# Altium project 20W_MultiOutput_FlybackCvt.PrjPcb
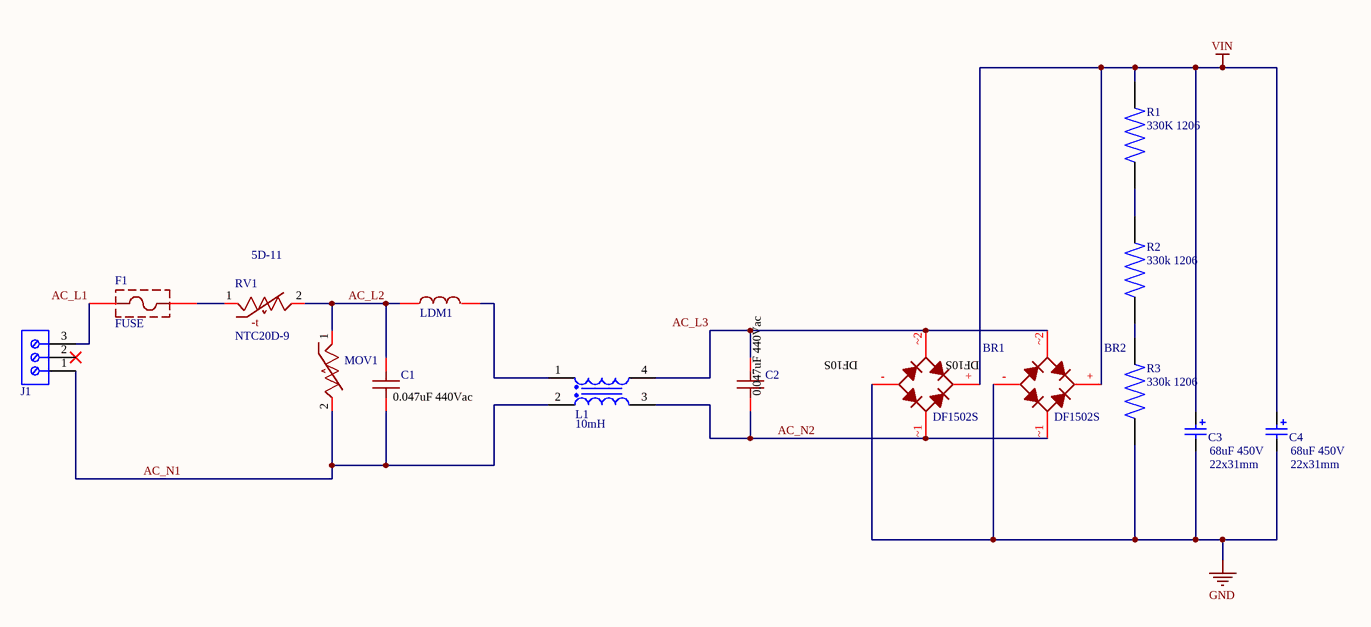
[diagram p0: EMI_Filter.SchDoc]
3 sheets, 103 parts. Net scope: global (net labels, ports and power ports of the same name join across sheets).
Board files: PCB.PcbDoc, PCB2.PcbDoc, PCB1.PcbDoc
Sheets:
  EMI_Filter.SchDoc
  Controller.SchDoc
  Transformer.SchDoc

## Sheet EMI_Filter.SchDoc: EMI Filter
size A3; SheetNumber: 1; SheetTotal: 3

### Parts
BR1  DBLS208GH  [DB SMD]  (value not drawn)
BR2  DBLS208GH  [DB SMD]  (value not drawn)
C1  Parameter 1: 0.047uF 440Vac  [R474I2470CKA2M]  (hidden comment: R474I2470CKA2M)
C2  Parameter 1: 0.047uF 440Vac  [R474I2470CKA2M]  (hidden comment: R474I2470CKA2M)
C3  82uF  [WCAP-AI3H_D22H30]  (value not drawn)
C4  82uF  [WCAP-AI3H_D22H30]  (value not drawn)
F1  FUSE  [FUSE]
J1  16A, 300V  [691213710003]  (value not drawn)
L1  10mH  [WE-FC_ET20H]
LDM1  SN5-300  [SN5300]  (value not drawn)
MOV1  MOV-14D751K  [B72214S2271K101]  (value not drawn)
R1  330K 1206  [RESC3116X65N]
R2  330k 1206  [RESC3116X65N]
R3  330k 1206  [RESC3116X65N]
RV1  NTC20D-9  [NTC20D9]

### Nets
GND: BR1.- BR2.- C3.2(N) C4.2(N) R3.1
VIN: BR1.+ BR2.+ C3.1(P) C4.1(P) R1.2
AC_L1: F1.1 J1.3
AC_L2: C1.1 LDM1.1 MOV1.1 RV1.2
AC_L3: BR1.~2 BR2.~2 C2.1 L1.4
AC_N1: C1.2 J1.1 L1.2 MOV1.2
AC_N2: BR1.~1 BR2.~1 C2.2 L1.3
NetF1_2: F1.2 RV1.1
NetL1_1: L1.1 LDM1.2
NetR1_1: R1.1 R2.2
NetR2_1: R2.1 R3.2

Not connected (* = marked no-connect by the designer): J1 2*

### Notes on the sheet
- (near RV1) 5D-11
- (near BR1) DF1502S
- (near BR2) DF1502S
- 68uF 450V
- 22x31mm
- (near C4) 68uF 450V
- (near C4) 22x31mm
- Project:
- XEVTECH COMPANY LIMITED
- Address: C17, Khu Barya City
- Drawn by:
- Size:
- A3
- Sheet
- of
- Date:
- TP Bà Rịa, Tỉnh Bà Rịa Vũng Tàu
- Email: admin@xevtech.vn
- Phone: 090 172 8898
- (in symbol BRIDGE RECT 1.2KV 2A) DF10S
- (in symbol NTC20D-9) -t

### Library data of the parts
BR1 BR2 = BRIDGE RECT 1.2KV 2A: Bridge Rectifier Single Phase Standard 1.2 kV Surface Mount DBLS; Manufacturer: FairchildSemiconductor; Peak Average Forward Current: 1.5@Ta=40CA; Peak Reverse Repetitive Voltage: 1000V; Peak Reverse Current: 5uA; Peak Forward Voltage: 1.1@1AV; Supplier 1: Digikey; Supplier Part Number 1: 1801-DBLS158GCT-ND; Datasheet Version: Rev. 1.5, 05/2015; Package: 4SDIPSMD; Operating Temperature: -55to150°C; Configuration: Single; Package Reference: SDIP 4L; Datasheet URL: http://www.farnell.com/datasheets/1941063.pdf; Packaging: Tape&Reel; Manufacturer URL: https://www.fairchildsemi.com/; Bridge Type: SinglePhase; Mounting Technology: SurfaceMount; Category: BridgeRectifier; Package Description: 4-Pin Surface Mount Device, Body 8.28 x 6.35 mm, Pitch 5.1 mm; Mounting: SurfaceMount
C1 C2 = R474I2470CKA2M: 0.047 µF Film Capacitor 440V 1000V (1kV) Polypropylene (PP), Metallized Radial; Manufacturer 1: KEMET; Description 1: Cap Film 0.047UF 20% 1KVDC Rad; Category 1: Film Capacitors; Capacitance: 47nF; Tolerance: 20%; Ratings: AEC-Q200,X1; Supplier 1: Digikey; Supplier Part Number 1: 399-17231-1-ND; Manufacturer Part Number 1: R474I2470CKA2M; RoHS 1: Yes; Stock 1: 4929; Pricing 1: 1=0,69, 10=0,482, 50=0,4056, 100=0,3302, 500=0,27518 (USD); ComponentLink1URL: https://datasheet.ciiva.com/46436/1848873-46436253.pdf?src-supplier=Element14; ComponentLink1Description: https://datasheet.ciiva.com/46436/1848873-46436253.pdf?src-supplier=Element14; Mount: Through Hole; Case/Package: Radial; Dielectric Material: PP; Min Operating Temperature: -40°C; Max Operating Temperature: 110°C; Series: R47; Packaging: Cut Tape; Voltage Rating (AC): 440V; Voltage Rating (DC): 1kV; Termination: PC Pins; RoHS Compliant: Yes
C3 C4 = 861141483002: WCAP-AI3H Aluminum Electrolytic Capacitor, Snap-In, D22xH30mm, 82uF, 450V; Manufacturer: Wurth Elektronik; Capacitance Tolerance: +/-20%; Dissipation Factor: 20%; Endurance: 3000h; Leakage Current: 576.28uA; Ripple Current: 640mA; Technical Reference: ANJN300820M450DSIC3C000; ComponentLink1Description: Manufacturer Link; ComponentLink1URL: https://www.we-online.com/redexpert/article/861141483002?ad; ComponentLink2Description: Datasheet; ComponentLink2URL: https://www.we-online.com/redexpert/spec/861141483002?ad; Category: Aluminum Electrolytic Capacitors; Match Code: WCAP-AI3H; Manufacturer Part Number: 861141483002; Mount: Through Hole; Operating Temperature Max: 105°C; Operating Temperature Min: -25°C; Packaging: Tray; Height: 30mm; Diameter: 22mm; Capacitance: 82uF; Rated Voltage (DC): 450V
F1 = FUSE: 2 A 250 V AC 125 V DC Fuse Board Mount (Cartridge Style); Manufacturer: Littelfuse; Manufacturer Part Number: 0505025.MXP; RoHS: Yes; Category: Fuses; Stock 1: 3122; Pricing 1: 1=5.43, 5=5.244, 10=5.057, 50=3.9336, 100=3.278, 250=3.18436, 500=2.71606, 1000=2.57558 (USD); ComponentLink1URL: https://datasheet.ciiva.com/26890/getdatasheetpartid-706019-26890404.pdf?src-supplier=Verical; ComponentLink1Description: https://datasheet.ciiva.com/26890/getdatasheetpartid-706019-26890404.pdf?src-supplier=Verical; ComponentLink2URL: https://datasheet.ciiva.com/29618/littelfuse-fuse-505-datasheet-pdf-29618152.pdf?src-supplier=Digi-Key; ComponentLink2Description: https://datasheet.ciiva.com/29618/littelfuse-fuse-505-datasheet-pdf-29618152.pdf?src-supplier=Digi-Key; ComponentLink3URL: https://datasheet.ciiva.com/300/littelfuse-fuse-505-300507.pdf?src-supplier=Digi-Key; ComponentLink3Description: https://datasheet.ciiva.com/300/littelfuse-fuse-505-300507.pdf?src-supplier=Digi-Key; ComponentLink4URL: https://datasheet.ciiva.com/7314/697468-7314411.pdf?src-supplier=Newark; ComponentLink4Description: https://datasheet.ciiva.com/7314/697468-7314411.pdf?src-supplier=Newark
J1 = 691213710003: WR-TBL Series 213 Horizontal Entry Modular, THT, pitch 5mm, 3p; Manufacturer: Wurth Elektronik; Modularity: Yes; Rated Current: 10A; ComponentLink1Description: Datasheet Link; ComponentLink1URL: https://www.we-online.com/redexpert/spec/691213710003?ad; ComponentLink2Description: Supplier 1 URL; ComponentLink2URL: N/A; Manufacturer Part Number: 691213710003; Category: Terminal Blocks; Match Code: WR-TBL; Mount: Through Hole; Operating Temperature Max: 105°C; Operating Temperature Min: -40°C; Packaging: Box; Application: Rising Cage Clamp; Number of Pins: 3; Number of Rows: 1; Orientation: Horizontal; Pitch: 5mm; Working Voltage: 300V; ComponentLink3Description: Supplier 2 URL; ComponentLink3URL: N/A; ComponentLink4Description: Supplier 3 URL; ComponentLink4URL: https://www.thegioiic.com/kf128-3-v-domino-3-chan-thang-5mm-300v-10a-han-pcb-loai-tot; Supplier 1 Name: Mouser; Supplier 1 SN: N/A; Supplier 1 URL: N/A; Supplier 2 Name: Digi-Key; Supplier 2 SN: N/A; Supplier 2 URL: N/A; Supplier 3 Name: thegioiic; Supplier 3 SN: N/A; Supplier 3 URL: https://www.thegioiic.com/kf128-3-v-domino-3-chan-thang-5mm-300v-10a-han-pcb-loai-tot; Value: 16A, 300V
L1 = 7448640399: WE-FC THT Common Mode Power Line Choke, ET20H, 5.9mH, 1.15A, 0.28Ω; Manufacturer: Wurth Elektronik; Insulation Test Voltage (AC): 2000V; Material: MnZn; Rated Voltage (AC): 250V; ComponentLink1Description: Website Link; ComponentLink1URL: https://www.we-online.com/redexpert/article/7448640399?ad; ComponentLink2Description: Datasheet Link; ComponentLink2URL: https://www.we-online.com/redexpert/spec/7448640399?ad; Manufacturer Part Number: 7448640399; Category: Common Mode Chokes; Match Code: WE-FC; Mount: Through Hole; Operating Temperature Max: 125°C; Operating Temperature Min: -40°C; Packaging: Tray; Case/Size Code: ET20H; Length: 21.3mm; Width: 21.3mm; Height: 17.8mm; DC Resistance: 0.28Ω; Inductance: 5.9mH; Rated Current: 1.15A
LDM1 = SN5-300: Filters 25uH 2A DCR=42mOhms; ComponentLink1URL: https://www.allegromicro.com/~/media/Files/Datasheets/ACS72981-Datasheet.ashx?src-supplier=Digi-Key; ComponentLink1Description: https://www.allegromicro.com/~/media/Files/Datasheets/ACS72981-Datasheet.ashx?src-supplier=Digi-Key; Supplier 1: Digikey; Supplier Part Number 1: 399-20548-ND
MOV1 = MOV-14D751K: 750 V 4.5 kA Varistor 1 Circuit Through Hole Disc 14mm; Manufacturer 1: Bourns; Description 1: Var MOV 460VAC/615VDC 4500A 750V Radial Bulk; Category 1: Varistors; Capacitance: 270pF; Voltage Rating (DC): 750V; Max Surge Current: 4.5kA; Current Rating: 50A; Tolerance: 10%; Max Voltage Rating (AC): 460V; Max Voltage Rating (DC): 615V; Clamping Voltage: 1.24kV; Number of Circuits: 1; Energy: 143J; Min Varistor Voltage: 675V; Max Varistor Voltage: 825V; Supplier 1: Digikey; Manufacturer Part Number 1: MOV-14D751K; RoHS 1: Yes; Stock 1: 4415; Pricing 1: 1=0,53, 10=0,458, 400=0,31723, 1200=0,20742, 5200=0,17691, 10000=0,16471 (USD); ComponentLink1URL: https://media.digikey.com/pdf/Data%20Sheets/Bourns%20PDFs/GMOV_Series_DS.pdf?src-supplier=Digi-Key; ComponentLink1Description: https://media.digikey.com/pdf/Data%20Sheets/Bourns%20PDFs/GMOV_Series_DS.pdf?src-supplier=Digi-Key; Supplier Part Number 1: 118-MOV-14D751K-ND; Mount: Radial,Through Hole; Case/Package: Radial; Weight: 0.105822oz; Min Operating Temperature: -40°C; Max Operating Temperature: 85°C; Packaging: Bulk; Package Quantity: 500; Clamping Current: 50A; Varistor Voltage: 750V; Series: -; Diameter: 14mm; Lead Pitch: 7.5mm; Radiation Hardening: No; RoHS Compliant: Yes; ComponentLink2URL: https://datasheet.ciiva.com/3026/mov14d-3026373.pdf?src-supplier=Avnet; ComponentLink2Description: https://datasheet.ciiva.com/3026/mov14d-3026373.pdf?src-supplier=Avnet; ComponentLink3URL: https://datasheet.ciiva.com/369/mov14d-369435.pdf?src-supplier=Digikey; ComponentLink3Description: https://datasheet.ciiva.com/369/mov14d-369435.pdf?src-supplier=Digikey
R1-R3 = RC1206JR-0713RL: 13 Ohms Â±5% 0.25W, 1/4W Chip Resistor 1206 (3216 Metric) Moisture Resistant Thick Film; MF: Yageo; Check_prices: https://www.snapeda.com/parts/RC1206JR-0713RL/Yageo/view-part/?ref=eda; Value: *; Availability: In Stock; MP: RC1206JR-0713RL; Price: None; Package: 3116 Yageo; SnapEDA_Link: https://www.snapeda.com/parts/RC1206JR-0713RL/Yageo/view-part/?ref=snap; Purchase-URL: https://pricing.snapeda.com/search/part/RC1206JR-0713RL/?ref=eda
RV1 = NTC20D-9: NTC Thermistor 20Ohms DIP 1A 25DegC  20R 9MM; MP: B72214S2271K101; MF: EPCOS; Digi-Key_Part_Number: 495-1441-ND; Check_prices: https://www.snapeda.com/parts/B72214S2271K101/EPCOS/view-part/?ref=eda; Package: None; Value: *; SnapEDA_Link: https://www.snapeda.com/parts/B72214S2271K101/EPCOS/view-part/?ref=snap; Purchase-URL: https://pricing.snapeda.com/search/part/B72214S2271K101/?ref=eda

## Sheet Controller.SchDoc: Controller
size A3; SheetNumber: 2; SheetTotal: 3
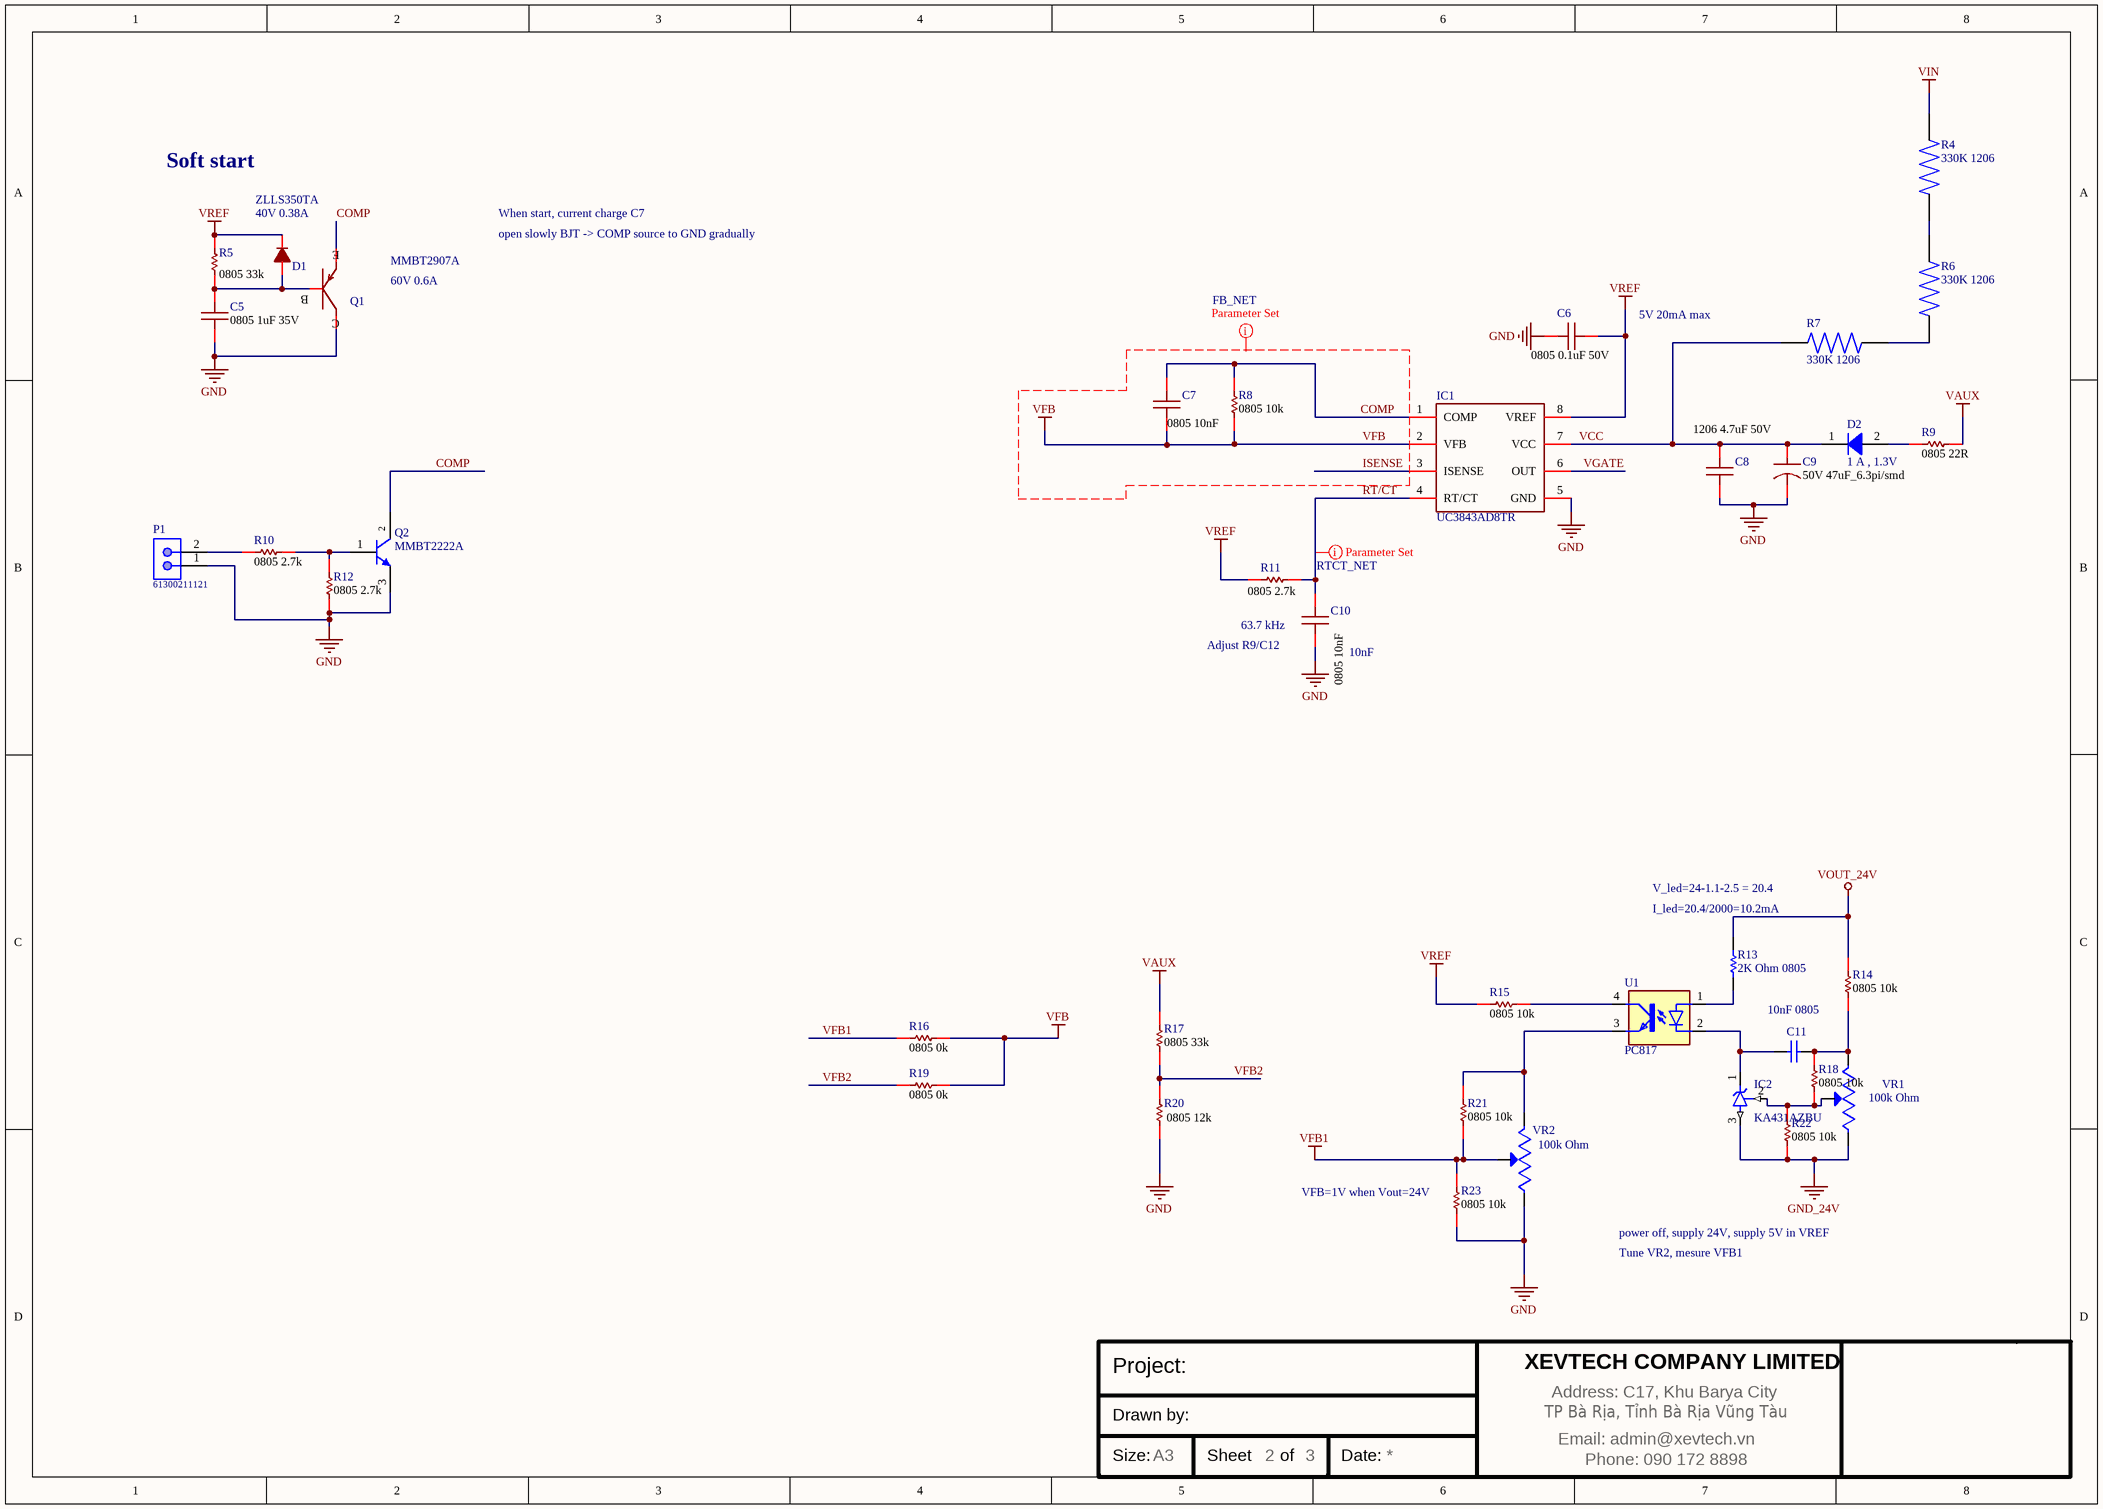
[diagram p1: Controller.SchDoc]

### Parts
C5  value 0805 1uF 35V  [CAP 0805]  (hidden comment: GRM219R7YA105KA12D)
C6  value 0805 0.1uF 50V  [CAP 0805]  (hidden comment: CL21B104KBCNNNC)
C7  value 0805 10nF  [CAP 0805]  (hidden comment: GRM2195C1H103JA01D)
C8  value 1206 4.7uF 50V  [Cap 1206]  (hidden comment: C3216X7R1H475M160AC)
C9  value 50V 47uF_6.3pi/smd  [C-50-47uf_alu]  (hidden comment: EEE-FK1H470XL)
C10  value 0805 10nF  [CAP 0805]  (hidden comment: GCM216R71H102KA37D)
C11  10nF 0805  [CAP_0805]
D1  PMEG3010EB,115  [SOD 523]  (value not drawn)
D2  1 A , 1.3V  [SMA (DO-214AC)]
IC1  UC3843AD8TR  [UC3843_SOIC8]
IC2  KA431AZBU  [SOT23-3]
P1  61300211121  [61300211121]
Q1  MMBT2907A  [SOT 23 3]
Q2  MMBT2222A  [MMBT-SOT23]
R4  330K 1206  [RESC3116X65N]
R5  value 0805 33k  [RES 0805]  (hidden comment: RC0805FR-0733KL)
R6  330K 1206  [RESC3116X65N]
R7  330K 1206  [RESC3116X65N]
R8  value 0805 10k  [RES 0805]  (hidden comment: RC0805FR-1310KL)
R9  value 0805 22R  [RES 0805]  (hidden comment: RC0805FR-0722RP)
R10  value 0805 2.7k  [Res 0805]  (hidden comment: RC0805FR-1312KL)
R11  value 0805 2.7k  [Res 0805]  (hidden comment: RC0805FR-1312KL)
R12  value 0805 2.7k  [Res 0805]  (hidden comment: RC0805FR-1312KL)
R13  2K Ohm 0805  [RESISTOR_0805]
R14  value 0805 10k  [Res 0805]  (hidden comment: RK73B2ATTD104J)
R15  value 0805 10k  [Res 0805]  (hidden comment: RK73B2ATTD104J)
R16  value 0805 0k  [RES 0805]  (hidden comment: RC0805FR-1310KL)
R17  value 0805 33k  [RES 0805]  (hidden comment: RC0805FR-1310KL)
R18  value 0805 10k  [Res 0805]  (hidden comment: RK73B2ATTD104J)
R19  value 0805 0k  [RES 0805]  (hidden comment: RC0805FR-1310KL)
R20  value 0805 12k  [RES 0805]  (hidden comment: RC0805FR-1310KL)
R21  value 0805 10k  [Res 0805]  (hidden comment: RK73B2ATTD104J)
R22  value 0805 10k  [Res 0805]  (hidden comment: RK73B2ATTD104J)
R23  value 0805 10k  [Res 0805]  (hidden comment: RK73B2ATTD104J)
U1  PC817  [PC817]
VR1  3296W-1-250  [TRIM_3296W-1-250]  (value not drawn)
VR2  3296W-1-250  [TRIM_3296W-1-250]  (value not drawn)

### Nets
GND: C5.2 C6.1 C8.2 C9.2 C10.2 IC1.5(GND) P1.1 Q1.C Q2.3(E) R12.2 R20.1 R23.2 VR2.1(CCW)
GND_24V: IC2.3(A) R22.2 VR1.1(CCW)
VAUX: R9.1 R17.2
VFB: C7.2 IC1.2(VFB) R8.1 R16.1 R19.1
VFB1: R16.2 R21.2 R23.1 VR2.2(WIPER)
VIN: R4.2
VOUT_24V: R13.2 R14.2
VREF: C6.2 D1.K IC1.8(VREF) R5.1 R11.2 R15.2
COMP: C7.1 IC1.1(COMP) Q1.E Q2.2(C) R8.2
ISENSE: IC1.3(ISENSE)
RT/CT: C10.1 IC1.4(RT/CT) R11.1
VCC: C8.1 C9.1 D2.1(K) IC1.7(VCC) R7.2
VFB2: R17.1 R19.2 R20.2
VGATE: IC1.6(OUT)
NetC5_1: C5.1 D1.A Q1.B R5.2
NetC11_1: C11.1 R14.1 R18.1 VR1.3(CW)
NetC11_2: C11.2 IC2.1(C) U1.2(C)
NetD2_2: D2.2(A) R9.2
NetIC2_2: IC2.2(REF) R18.2 R22.1 VR1.2(WIPER)
NetP1_2: P1.2 R10.1
NetQ2_1: Q2.1(B) R10.2 R12.1
NetR4_1: R4.1 R6.2
NetR6_1: R6.1 R7.1
NetR13_1: R13.1 U1.1(A)
NetR15_1: R15.1 U1.4(COL)
NetR21_1: R21.1 U1.3(EMIT) VR2.3(CW)

### Layout directives
net class FB_NET: COMP, ISENSE, VFB
net class RTCT_NET: RT/CT

### Notes on the sheet
- Soft start
- ZLLS350TA
- 40V 0.38A
- When start, current charge C7
- open slowly BJT -> COMP source to GND gradually
- 60V 0.6A
- 5V 20mA max
- (near C10) Adjust R9/C12
- 63.7 kHz
- (near C10) 10nF
- V_led=24-1.1-2.5 = 20.4
- (near R13) I_led=20.4/2000=10.2mA
- (near VR1) 100k Ohm
- (near VR2) 100k Ohm
- (near R23) VFB=1V when Vout=24V
- power off, supply 24V, supply 5V in VREF
- Tune VR2, mesure VFB1
- Project:
- XEVTECH COMPANY LIMITED
- Address: C17, Khu Barya City
- Drawn by:
- Size:
- A3
- Sheet
- of
- Date:
- TP Bà Rịa, Tỉnh Bà Rịa Vũng Tàu
- Email: admin@xevtech.vn
- Phone: 090 172 8898

### Library data of the parts
C5 = Cap 0805 1uF: 1 µF ±10% 35V Ceramic Capacitor X7R 0805 (2012 Metric); Supplier 1: Digi-Key; Supplier Part Number 1: 490-10494-1-ND
C6 = Cap 0805 0.1uF: 0.1 µF ±10% 50V Ceramic Capacitor X7R 0805 (2012 Metric); Manufacturer 1: Samsung; Description 1: Multilayer Ceramic Capacitor, 0.1 uF, 50 V, ± 10%, X7R, 0805 [2012 Metric]; Category 1: Ceramic Capacitors; Supplier 1: Digi-Key; Supplier Part Number 1: 1276-1003-1-ND; Manufacturer Part Number 1: CL21B104KBCNNNC; RoHS 1: Yes; Stock 1: 559254; Pricing 1: 1=0,1, 10=0,044, 50=0,024, 100=0,0196, 500=0,01404, 1000=0,01103 (USD); ComponentLink1URL: https://datasheet.ciiva.com/25710/cl21b104kbcnnnc-25710182.pdf?src-supplier=Digi-Key; ComponentLink1Description: https://datasheet.ciiva.com/25710/cl21b104kbcnnnc-25710182.pdf?src-supplier=Digi-Key; ComponentLink2URL: https://datasheet.ciiva.com/29199/454152-da-01-en-vs-kondensator-0805-29199814.pdf?src-supplier=Conrad; ComponentLink2Description: https://datasheet.ciiva.com/29199/454152-da-01-en-vs-kondensator-0805-29199814.pdf?src-supplier=Conrad
C7 = Cap 0805 10nF: 10000 pF ±5% 50V Ceramic Capacitor C0G, NP0 0805 (2012 Metric); Manufacturer 1: Murata; Manufacturer Part Number 1: GRM21BR61H106KE43L; Description 1: Capacitor Ceramic Multilayer; Category 1: Ceramic Capacitors; Supplier 1: Digikey; Supplier Part Number 1: 490-1642-1-ND; RoHS 1: Yes; Stock 1: 19692; Pricing 1: 1=0,3, 10=0,209, 50=0,139, 100=0,1182, 500=0,08342, 1000=0,073 (USD); ComponentLink1URL: https://datasheet.octopart.com/GRM21BR61H106KE43L-Murata-datasheet-155345082.pdf?src-supplier=Element14; ComponentLink1Description: https://datasheet.octopart.com/GRM21BR61H106KE43L-Murata-datasheet-155345082.pdf?src-supplier=Element14; ComponentLink2URL: https://search.murata.co.jp/Ceramy/image/img/A01X/G101/ENG/GRM21BR61H106KE43-01A.pdf?src-supplier=Digi-Key; ComponentLink2Description: https://search.murata.co.jp/Ceramy/image/img/A01X/G101/ENG/GRM21BR61H106KE43-01A.pdf?src-supplier=Digi-Key; ComponentLink3URL: https://datasheet.octopart.com/GRM21BR61H106KE43L-Murata-datasheet-165579666.pdf?src-supplier=TME; ComponentLink3Description: https://datasheet.octopart.com/GRM21BR61H106KE43L-Murata-datasheet-165579666.pdf?src-supplier=TME
C8 = Cap 1206 4.7uF: 4.7 µF ±20% 50V Ceramic Capacitor X7R 1206 (3216 Metric); Manufacturer 1: TDK; Manufacturer Part Number 1: CGA5L1X7R1V106M160AC; Description 1: Cap Ceramic 10uF 35V X7R 20% SMD 1206 125°C Blister Plastic T/R; Category 1: Ceramic Capacitors; Capacitance: 10uF; Voltage Rating: 35V; RoHS 1: Yes; Stock 1: 4126; Pricing 1: 1=0,72, 10=0,53, 50=0,4242, 100=0,3636, 500=0,28784, 1000=0,2424 (USD); Mount: Surface Mount; Case/Package: 1206; Case Code (Imperial): 1206; Case Code (Metric): 3216; Weight: 0.000571oz; Min Operating Temperature: -55°C; Max Operating Temperature: 125°C; Packaging: Tape and Reel; Tolerance: 20%; Dielectric: X7R; Termination: SMD/SMT; Voltage Rating (DC): 35V; Package Quantity: 2000; Series: CGA; Length: 0.126inch; Width: 1.6mm; Height: 1.6mm; Thickness: 0.071inch; Ratings: AEC-Q200; RoHS Compliant: Yes; ComponentLink1URL: https://product.tdk.com/info/en/catalog/datasheets/mlcc_automotive_general_en.pdf?src-supplier=Digi-Key; ComponentLink1Description: https://product.tdk.com/info/en/catalog/datasheets/mlcc_automotive_general_en.pdf?src-supplier=Digi-Key; ComponentLink2URL: http://product.tdk.com/capacitor/mlcc/detailed_information.php?lang=en&ref=jp&part_no=CGA5L1X7R1V106M160AC&src-supplier=Mouser; ComponentLink2Description: http://product.tdk.com/capacitor/mlcc/detailed_information.php?lang=en&ref=jp&part_no=CGA5L1X7R1V106M160AC&src-supplier=Mouser; ComponentLink3URL: http://product.tdk.com/capacitor/mlcc/class/print_detail_pdf.php?lang=en&part_no=CGA5L1X7R1V106M160AC&src-supplier=Avnet; ComponentLink3Description: http://product.tdk.com/capacitor/mlcc/class/print_detail_pdf.php?lang=en&part_no=CGA5L1X7R1V106M160AC&src-supplier=Avnet; ComponentLink4URL: https://product.tdk.com/info/en/catalog/spec/mlccspec_automotive_general_midvoltage_en.pdf?src-supplier=Digi-Key; ComponentLink4Description: https://product.tdk.com/info/en/catalog/spec/mlccspec_automotive_general_midvoltage_en.pdf?src-supplier=Digi-Key; Supplier 1: Digikey; Supplier Part Number 1: 445-8033-1-ND
C9 = Capacitor-50V 47u_6.3pi: CAP ALUM 47UF 20% 50V SMD; Manufacturer: Panasonic; Supplier Part Number: 10-EEE-FK1H470XLCTND; Package/Case: 6.3mm (dia); Supplier 1: Digi-Key; Supplier Part Number 1: 10-EEE-FK1H470XLCT-ND
C10 = Cap 0805 1nF: 1000 pF 50 VDC 10% 0805 X7R; Manufacturer 1: Murata; Manufacturer Part Number 1: GRM21BR61H106KE43L; Description 1: Capacitor Ceramic Multilayer; Category 1: Ceramic Capacitors; Supplier 1: Digikey; Supplier Part Number 1: 490-6057-1-ND; RoHS 1: Yes; Stock 1: 19692; Pricing 1: 1=0,3, 10=0,209, 50=0,139, 100=0,1182, 500=0,08342, 1000=0,073 (USD); ComponentLink1URL: https://datasheet.octopart.com/GRM21BR61H106KE43L-Murata-datasheet-155345082.pdf?src-supplier=Element14; ComponentLink1Description: https://datasheet.octopart.com/GRM21BR61H106KE43L-Murata-datasheet-155345082.pdf?src-supplier=Element14; ComponentLink2URL: https://search.murata.co.jp/Ceramy/image/img/A01X/G101/ENG/GRM21BR61H106KE43-01A.pdf?src-supplier=Digi-Key; ComponentLink2Description: https://search.murata.co.jp/Ceramy/image/img/A01X/G101/ENG/GRM21BR61H106KE43-01A.pdf?src-supplier=Digi-Key; ComponentLink3URL: https://datasheet.octopart.com/GRM21BR61H106KE43L-Murata-datasheet-165579666.pdf?src-supplier=TME; ComponentLink3Description: https://datasheet.octopart.com/GRM21BR61H106KE43L-Murata-datasheet-165579666.pdf?src-supplier=TME
C11 = 0108058281050: CAP, size 0805, 8.2 uF, 50 VDC; Manufacture Name: TDK; Manufacture SN: CGA4C2C0G1H822J060AA; Capacitance: 8.2 uF; Tolerance: +/-5%; Voltage Rating DC: 50 VDC; ComponentLink2Description: Datasheet; ComponentLink2URL: https://product.tdk.com/system/files/dam/doc/product/capacitor/ceramic/mlcc/catalog/mlcc_automotive_general_en.pdf?ref_disty=mouser; Operating Temperature: -55 to +125degC; Packaging: Tape and Reel; Mounting Technology: SMT; Size: 0805; Supplier 1 Name: Mouser; Supplier 1 SN: 810-CGA4C2C0G1H822J; Supplier 1 URL: https://www.mouser.vn/ProductDetail/TDK/CGA4C2C0G1H822J060AA?qs=FxQuwy19cyAK0jQ6P5l0pQ%3D%3D&utm_source=mouser-refine-download&utm_medium=file&utm_campaign=CGA4C2C0G1H822J060AA&utm_content=TDK; Supplier 2 Name: Digi-Key; Supplier 2 SN: 445-6946-2-ND; Supplier 2 URL: https://www.digikey.com/en/products/detail/tdk-corporation/cga4c2c0g1h822j060aa/2672839; Supplier 3 Name: thegioiic; Supplier 3 SN: OEM; Supplier 3 URL: N/A; Value: 8.2 uF, 50 VDC
D1 = Diode 30V 1A: Diode 30 V 1A Surface Mount SOD-523; Manufacturer 1: Nexperia; Description 1: Rectifier Diode, Schottky, 1 Phase, 1 Element, 1A, Silicon; Category 1: Rectifier Diodes; Max Reverse Leakage Current: 500uA; Max Surge Current: 3A; Max Repetitive Reverse Voltage (Vrrm): 30V; Peak Non-Repetitive Surge Current: 5A; Element Configuration: 5460ElementConfiguration; Forward Voltage: 680mV; Supplier 1: Digikey; Supplier Part Number 1: 1727-5834-1-ND; ComponentLink1URL: https://datasheet.octopart.com/BZX585-C9V1%2C135-Nexperia-datasheet-81456219.pdf?src-supplier=Future+Electronics; ComponentLink1Description: https://datasheet.octopart.com/BZX585-C9V1%2C135-Nexperia-datasheet-81456219.pdf?src-supplier=Future+Electronics; Manufacturer Part Number 1: PMEG3010EB,115; RoHS 1: Yes; Stock 1: 7761; Pricing 1: 1=0,46, 10=0,326, 100=0,1644, 500=0,14572, 1000=0,11341, 3000=0,1015, 6000=0,09923, 9000=0,08789, 30000=0,08676, 75000=0,07371 (USD); Mount: 8Mount; Number of Pins: 2NUMBER; Min Operating Temperature: -65°C; Max Operating Temperature: 150°C; Forward Current: 1A; Max Reverse Voltage (DC): 30V; Max Reverse Current: 500uA; Average Rectified Current: 1A; Max Forward Surge Current (Ifsm): 5A; Radiation Hardening: 5898YesNo; RoHS Compliant: Yes; Lead Free: 5697LeadFree; Reach SVHC Compliant: 4186SVHC; ComponentLink2URL: https://assets.nexperia.com/documents/packing/SOD523_115.pdf?src-supplier=Digikey; ComponentLink2Description: https://assets.nexperia.com/documents/packing/SOD523_115.pdf?src-supplier=Digikey; ComponentLink3URL: https://datasheet.octopart.com/PMEG3010EB%2C115-Nexperia-datasheet-12552804.pdf?src-supplier=Farnell; ComponentLink3Description: https://datasheet.octopart.com/PMEG3010EB%2C115-Nexperia-datasheet-12552804.pdf?src-supplier=Farnell
D2 = RS1M: Rectifiers 1000V 1a Fast Rect SMa; Manufacturer: onsemi; Max Surge Current: 30 A; Peak Reverse Voltage: 1 kV; Power Dissipation: 1.19 W; Recovery Time: 500 ns; Reverse Current: 5 uA; Type: Rectifiers; Supplier 1 URL: https://www.mouser.vn/ProductDetail/onsemi-Fairchild/RS1M?qs=e%2FRqmsgwm9icSRWI%2F467wA%3D%3D; Supplier 2 URL: https://www.digikey.com/en/products/detail/onsemi/rs1m/1048919; Supplier 3 URL: https://www.thegioiic.com/fr107-rs1m-sma-diode-chinh-luu-1a-1kv; Value: 1 A , 1.3V; Forward Current: 1 A; Forward Voltage: 1.3 V; Maximum Diode Capacitance: N/A; Manufacturer Part Number: RS1M; Supplier 1: Mouser; Supplier 1 Part Number: 512-RS1M; Supplier 2: Digi-Key; Supplier 2 Part Number: RS1MFSTR-ND; Supplier 3: thegioiic; Supplier 3 Part Number: FR107 RS1M; Mount: SMD/SMT; Operating Temperature Max: + 85 C; Operating Temperature Min: - 40 C; Package / Case: DO-214AC; ComponentLink1Description: Datasheet; ComponentLink1URL: https://www.mouser.vn/datasheet/2/308/1/RS1M_D-2320127.pdf; Packaging: Tape and Reel; LCSC Part #: N/A
IC1 = UC3843AD8TR: UC3843 Switching IC 8.4V 500kHz; Supplier 1: Digikey; Supplier Part Number 1: 296-27152-1-ND
P1 = 61300211121: WR-PHD Pin Header, THT, pitch 2.54mm, Single Row, Vertical, 2p; Manufacturer: Wurth Elektronik; Pin Number: 2; Rated Current: 3A; Working Voltage: 250VAC; Withstanding Voltage: 500VAC; Contact Resistance: 20mOhm; Supply Name 1: Mouser; ComponentLink1Description: Manufacturer; ComponentLink1URL: http://www.we-online.de; ComponentLink2Description: Datasheet; ComponentLink2URL: https://www.we-online.com/catalog/datasheet/61300211121.pdf; Manufacturer Part Number: 61300211121; Published Date: May 2020; Pitch: 2.54mm; Operating Temperature: -40 to +105degC; Mounting Technology: THT; Packaging: Bag; Gender: Pin Header; Row Number: Single; Orientation: Vertical; ComponentLink3Description: Global Supply; ComponentLink3URL: https://www.mouser.vn/ProductDetail/Wurth-Elektronik/61300211121?qs=t4813l51qx%252B1A5GYDQxPlw%3D%3D; Supplier 1 Name: Mouser; Supplier 1 SN: 710-61300211121; Supplier 1 URL: https://www.mouser.vn/ProductDetail/Wurth-Elektronik/61300211121?qs=t4813l51qx%252B1A5GYDQxPlw%3D%3D; Supplier 2 Name: Digi-Key; Supplier 2 SN: N/A; Supplier 2 URL: N/A; Supplier 3 Name: thegioiic; Supplier 3 SN: N/A; Supplier 3 URL: N/A
Q1 = BJT PNP 40V: Trans GP BJT PNP 40V 0.2A 300mW Automotive 3-Pin SOT-23 T/R; Manufacturer 1: ON Semiconductor; Manufacturer Part Number 1: SMMBT3906LT1G; Category 1: BJTs; Supplier 1: Digikey; Supplier Part Number 1: SMMBT3906LT1GOSCT-ND; RoHS 1: Yes; Description 1: Trans GP BJT PNP 40V 0.2A 300mW Automotive 3-Pin SOT-23 T/R; Stock 1: 92580; Pricing 1: 1=0,17, 10=0,124, 100=0,0667, 500=0,05236, 1000=0,03636, 3000=0,03012, 6000=0,02848, 9000=0,02424, 30000=0,02242, 75000=0,01939, 150000=0,01612 (USD); Lead Free: 5697LeadFree; ComponentLink1URL: https://datasheet.ciiva.com/980/mmbt3906lt1-d-980808.pdf?src-supplier=Digikey; ComponentLink1Description: https://datasheet.ciiva.com/980/mmbt3906lt1-d-980808.pdf?src-supplier=Digikey; ComponentLink2URL: https://datasheet.ciiva.com/16285/mmbt3906lt1-d-16285303.pdf?src-supplier=Mouser; ComponentLink2Description: https://datasheet.ciiva.com/16285/mmbt3906lt1-d-16285303.pdf?src-supplier=Mouser; ComponentLink3URL: https://datasheet.ciiva.com/11204/mmbt3906lt1-d-11204922.pdf?src-supplier=Avnet; ComponentLink3Description: https://datasheet.ciiva.com/11204/mmbt3906lt1-d-11204922.pdf?src-supplier=Avnet
Q2 = MMBT2222A: TRANS NPN, 40V, 600MA, SOT23-3; DC Current Gain: 35-300; Gain Bandwidth Product fT: 250MHz; Power Dissipation: 250mW; Current - Collector: 600mA; Package: SOT-23; Supplier 1 Name: Mouser; Supplier 1 SN: 637-MMBT2222A; Supplier 1 URL: https://www.mouser.vn/ProductDetail/Diotec-Semiconductor/MMBT2222A?qs=OlC7AqGiEDl9N1c3%252BL%2F%252Brw%3D%3D; Supplier 2 Name: Digi-Key; Supplier 2 SN: 2796-MMBT2222ATR-ND; Supplier 2 URL: https://www.digikey.com/en/products/detail/diotec-semiconductor/MMBT2222A/13163394; Supplier 3 Name: thegioiic; Supplier 3 URL: https://www.thegioiic.com/mmbt2222a-transistor-npn-40v-0-6a-3-chan-sot-23; Transistor Type: NPN; Voltage - Collector Emitter Breakdown: 40V; Supplier 3 SN: N/A; Value: MMBT2222A
R4 R6 R7 = RC1206JR-0713RL: as R1 on sheet EMI_Filter; Check_prices: https://www.snapeda.com/parts/RC1206JR-0713RL/Yageo/view-part/?ref=eda; Value: *; Availability: In Stock; MP: RC1206JR-0713RL; Price: None; Package: 3116 Yageo; SnapEDA_Link: https://www.snapeda.com/parts/RC1206JR-0713RL/Yageo/view-part/?ref=snap; Purchase-URL: https://pricing.snapeda.com/search/part/RC1206JR-0713RL/?ref=eda
R5 = RES_0805_33k: 33 kOhms ±1% 0.125W, 1/8W Chip Resistor 0805 (2012 Metric) Moisture Resistant Thick Film; Manufacturer 1: Yageo; Manufacturer Part Number 1: AC0805FR-0733RL; Description 1: SMD Chip Resistor, 33 Ohm, ± 1%, 125 mW, 0805 [2012 Metric], Thick Film, General Purpose; Category 1: Chip SMD Resistors; RoHS 1: Yes; Stock 1: 24620; Pricing 1: 1=0,1, 10=0,029, 50=0,0188, 100=0,0158, 500=0,01096, 1000=0,00948 (USD); ComponentLink1URL: http://www.mouser.com/ds/2/447/yageodocoutput-1111992.pdf?src-supplier=Mouser; ComponentLink1Description: http://www.mouser.com/ds/2/447/yageodocoutput-1111992.pdf?src-supplier=Mouser; ComponentLink2URL: http://www.yageo.com/NewPortal/yageodocoutput?fileName=/pdf/R-Chip/PYu-AC_51_RoHS_L_6.pdf&src-supplier=Digi-Key; ComponentLink2Description: http://www.yageo.com/NewPortal/yageodocoutput?fileName=/pdf/R-Chip/PYu-AC_51_RoHS_L_6.pdf&src-supplier=Digi-Key; ComponentLink3URL: https://www.yageo.com/upload/media/product/productsearch/datasheet/rchip/PYu-AC_51_RoHS_L_7.pdf?src-supplier=Digi-Key; ComponentLink3Description: https://www.yageo.com/upload/media/product/productsearch/datasheet/rchip/PYu-AC_51_RoHS_L_7.pdf?src-supplier=Digi-Key; ComponentLink4URL: http://www.yageo.com/NewPortal/yageodocoutput?fileName=/pdf/R-Chip/PYu-AC_51_RoHS_L_5.pdf&src-supplier=Digi-Key; ComponentLink4Description: http://www.yageo.com/NewPortal/yageodocoutput?fileName=/pdf/R-Chip/PYu-AC_51_RoHS_L_5.pdf&src-supplier=Digi-Key; ComponentLink5URL: https://datasheet.octopart.com/AC0805FR-0733RL-Yageo-datasheet-151884373.pdf?src-supplier=Future+Electronics; ComponentLink5Description: https://datasheet.octopart.com/AC0805FR-0733RL-Yageo-datasheet-151884373.pdf?src-supplier=Future+Electronics; Supplier 1: Future Electronics; Supplier Part Number 1: 1593995
R8 R16 R17 R19 R20 = RES_0805_10k: 10 kOhms ±1% 0.125W, 1/8W Chip Resistor 0805 (2012 Metric) Moisture Resistant Thick Film; Supplier 1: Digi-Key; Supplier Part Number 1: 13-RC0805FR-1310KLDKR-ND
R9 = RES_0805_22R: 22 Ohms ±1% 0.125W, 1/8W Chip Resistor 0805 (2012 Metric) Automotive AEC-Q200, Moisture Resistant Thick Film; Manufacturer 1: Yageo; Manufacturer Part Number 1: AC0805FR-0733RL; Description 1: SMD Chip Resistor, 33 Ohm, ± 1%, 125 mW, 0805 [2012 Metric], Thick Film, General Purpose; Category 1: Chip SMD Resistors; Supplier 1: Digikey; RoHS 1: Yes; Stock 1: 24620; Pricing 1: 1=0,1, 10=0,029, 50=0,0188, 100=0,0158, 500=0,01096, 1000=0,00948 (USD); ComponentLink1URL: http://www.mouser.com/ds/2/447/yageodocoutput-1111992.pdf?src-supplier=Mouser; ComponentLink1Description: http://www.mouser.com/ds/2/447/yageodocoutput-1111992.pdf?src-supplier=Mouser; ComponentLink2URL: http://www.yageo.com/NewPortal/yageodocoutput?fileName=/pdf/R-Chip/PYu-AC_51_RoHS_L_6.pdf&src-supplier=Digi-Key; ComponentLink2Description: http://www.yageo.com/NewPortal/yageodocoutput?fileName=/pdf/R-Chip/PYu-AC_51_RoHS_L_6.pdf&src-supplier=Digi-Key; ComponentLink3URL: https://www.yageo.com/upload/media/product/productsearch/datasheet/rchip/PYu-AC_51_RoHS_L_7.pdf?src-supplier=Digi-Key; ComponentLink3Description: https://www.yageo.com/upload/media/product/productsearch/datasheet/rchip/PYu-AC_51_RoHS_L_7.pdf?src-supplier=Digi-Key; ComponentLink4URL: http://www.yageo.com/NewPortal/yageodocoutput?fileName=/pdf/R-Chip/PYu-AC_51_RoHS_L_5.pdf&src-supplier=Digi-Key; ComponentLink4Description: http://www.yageo.com/NewPortal/yageodocoutput?fileName=/pdf/R-Chip/PYu-AC_51_RoHS_L_5.pdf&src-supplier=Digi-Key; ComponentLink5URL: https://datasheet.octopart.com/AC0805FR-0733RL-Yageo-datasheet-151884373.pdf?src-supplier=Future+Electronics; ComponentLink5Description: https://datasheet.octopart.com/AC0805FR-0733RL-Yageo-datasheet-151884373.pdf?src-supplier=Future+Electronics; Supplier Part Number 1: 13-RC0805FR-0722RPCT-ND
R10-R12 = RES_0805_12k: 12 kOhms ±1% 0.125W, 1/8W Chip Resistor 0805 (2012 Metric) Moisture Resistant Thick Film; Supplier 1: Digikey; Supplier Part Number 1: 13-RC0805FR-1312KLCT-ND
R13 = 00080545311: RES, size 0805, 4.53 KOhm, 1/8W; Resistance Tolerance: +/-1%; Resistance: 4.53 KOhm; Size: 0805; Rated Power: 1/8 W; Supplier 1 Name: Mouser; Supplier 1 SN: 652-CR0805FX-4532ELF; Supplier 1 URL: https://www.mouser.vn/ProductDetail/Bourns/CR0805-FX-4532ELF?qs=sGAEpiMZZMtG0KNrPCHnjfC2zYK6Lg3%2F1%2Fel6VE8vT0%3D; Supplier 2 Name: Digi-Key; Supplier 2 SN: 311-45.3KCRDKR-ND; Supplier 2 URL: https://www.digikey.com/en/products/detail/yageo/RC0805FR-0745K3L/727965; Mounting Technology: SMT; Supplier 3 Name: Thegioiic; Supplier 3 SN: N/A; Supplier 3 URL: N/A; Manufacture  Name: N/A; Manufacture  SN: N/A; Value: 4.53 KOhm, 1/8W; ComponentLink1Description: Datasheet link; ComponentLink1URL: N/A; ComponentLink2Description: Supplier 1 URL; ComponentLink2URL: https://www.mouser.vn/ProductDetail/Bourns/CR0805-FX-4532ELF?qs=sGAEpiMZZMtG0KNrPCHnjfC2zYK6Lg3%2F1%2Fel6VE8vT0%3D; ComponentLink3Description: Supplier 2 URL; ComponentLink3URL: https://www.digikey.com/en/products/detail/yageo/RC0805FR-0745K3L/727965; ComponentLink4Description: Supplier 3 URL; ComponentLink4URL: N/A
R14 R15 R18 R21-R23 = RES_0805_100k: 100 kOhms ±1% 0.250W, 1/4W Chip Resistor 0805; Supplier 1: Digikey; Supplier Part Number 1: 2019-RK73B2ATTD104JCT-ND
VR1 VR2 = 3296W-1-250: 25 Ohms 0.5W, 1/2W PC Pins Through Hole Trimmer Potentiometer Cermet 25.0 Turn Top Adjustment; MF: Bourns; Purchase-URL: https://pricing.snapeda.com/search/part/3296W-1-250/?ref=eda; Check_prices: https://www.snapeda.com/parts/3296W-1-250/Bourns/view-part/?ref=eda; SnapEDA_Link: https://www.snapeda.com/parts/3296W-1-250/Bourns/view-part/?ref=snap; Price: None; Availability: In Stock; Package: NON STANDARD-3 Bourns; MP: 3296W-1-250; Value: *

## Sheet Transformer.SchDoc: Transformer
size A3; SheetNumber: 3; SheetTotal: 3
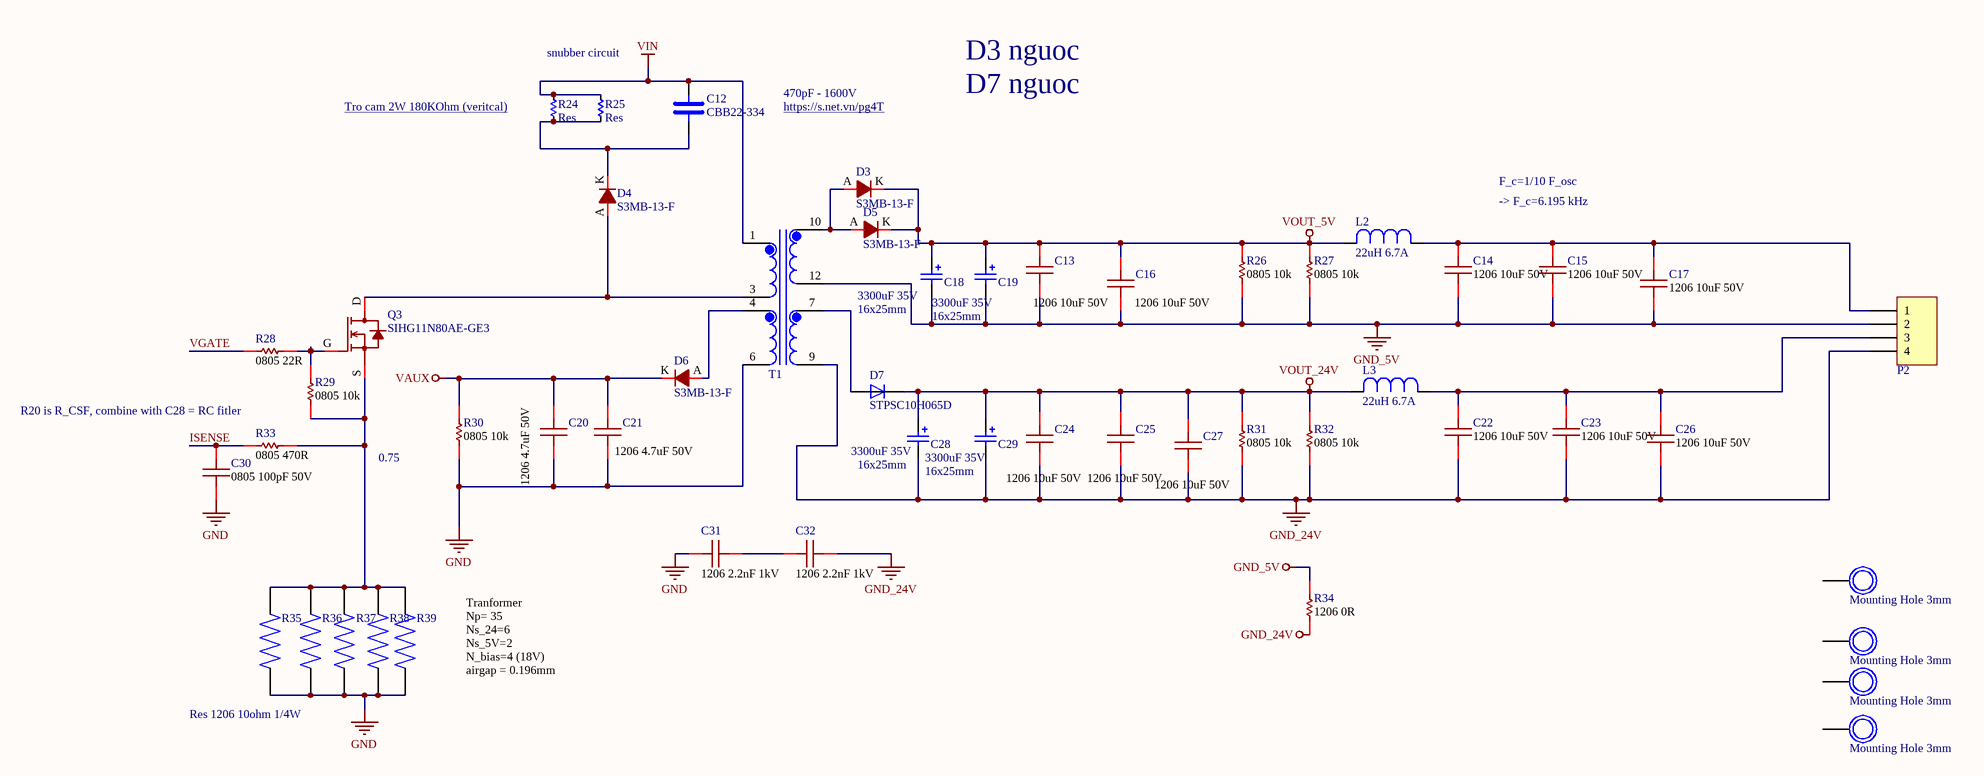
[diagram p2: Transformer.SchDoc]

### Parts
C12  CBB22-334  [Cap 1600v]
C13  value 1206 10uF 50V  [Cap 1206]  (hidden comment: C3216X7R1H475M160AC)
C14  value 1206 10uF 50V  [Cap 1206]  (hidden comment: C3216X7R1H475M160AC)
C15  value 1206 10uF 50V  [Cap 1206]  (hidden comment: C3216X7R1H475M160AC)
C16  value 1206 10uF 50V  [Cap 1206]  (hidden comment: C3216X7R1H475M160AC)
C17  value 1206 10uF 50V  [Cap 1206]  (hidden comment: C3216X7R1H475M160AC)
C18  2700uF  [WCAP-ATG8_D16H25]  (value not drawn)
C19  2700uF  [WCAP-ATG8_D16H25]  (value not drawn)
C20  value 1206 4.7uF 50V  [Cap 1206]  (hidden comment: C3216X7R1H475M160AC)
C21  value 1206 4.7uF 50V  [Cap 1206]  (hidden comment: C3216X7R1H475M160AC)
C22  value 1206 10uF 50V  [Cap 1206]  (hidden comment: C3216X7R1H475M160AC)
C23  value 1206 10uF 50V  [Cap 1206]  (hidden comment: C3216X7R1H475M160AC)
C24  value 1206 10uF 50V  [Cap 1206]  (hidden comment: C3216X7R1H475M160AC)
C25  value 1206 10uF 50V  [Cap 1206]  (hidden comment: C3216X7R1H475M160AC)
C26  value 1206 10uF 50V  [Cap 1206]  (hidden comment: C3216X7R1H475M160AC)
C27  value 1206 10uF 50V  [Cap 1206]  (hidden comment: C3216X7R1H475M160AC)
C28  2700uF  [WCAP-ATG8_D16H25]  (value not drawn)
C29  2700uF  [WCAP-ATG8_D16H25]  (value not drawn)
C30  Parameter 1: 0805 100pF 50V  [CAP 0805]  (hidden comment: C0805C101J5RACTU)
C31  value 1206 2.2nF 1kV  [Cap 1206]  (hidden comment: CC1206KKX7RCBB222)
C32  value 1206 2.2nF 1kV  [Cap 1206]  (hidden comment: CC1206KKX7RCBB222)
D3  S3MB-13-F  [DIODE 1kV 3A]
D4  S3MB-13-F  [DIODE 1kV 3A]
D5  S3MB-13-F  [DIODE 1kV 3A]
D6  S3MB-13-F  [DIODE 1kV 3A]
D7  STPSC10H065D  [TO508P1016X470X2286-2]
H1  Mounting Hole 3mm  [3mm with via]
H2  Mounting Hole 3mm  [3mm with via]
H3  Mounting Hole 3mm  [3mm with via]
H4  Mounting Hole 3mm  [3mm with via]
L2  22uH 6.7A  [IND_CDRH127/LDNP-470MC_SUM]
L3  22uH 6.7A  [IND_CDRH127/LDNP-470MC_SUM]
P2  Domino 4  [DOMINO 4 -5mm]  (value not drawn)
Q3  SIHG11N80AE-GE3  [N-CH MOSFET 1k2V]
R24  Res  [RES-1WD]
R25  Res  [RES-1WD]
R26  value 0805 10k  [RES 0805]  (hidden comment: RC0805FR-1310KL)
R27  value 0805 10k  [RES 0805]  (hidden comment: RC0805FR-1310KL)
R28  value 0805 22R  [RES 0805]  (hidden comment: RC0805FR-0722RP)
R29  value 0805 10k  [RES 0805]  (hidden comment: RC0805FR-1310KL)
R30  value 0805 10k  [RES 0805]  (hidden comment: RC0805FR-1310KL)
R31  value 0805 10k  [RES 0805]  (hidden comment: RC0805FR-1310KL)
R32  value 0805 10k  [RES 0805]  (hidden comment: RC0805FR-1310KL)
R33  value 0805 470R  [RES 0805]  (hidden comment: RC0805FR-07470RP)
R34  value 1206 0R  [RES 1206]  (hidden comment: RES_1206_0R)
R35  RC1206JR-0713RL  [RESC3116X65N]  (value not drawn)
R36  RC1206JR-0713RL  [RESC3116X65N]  (value not drawn)
R37  RC1206JR-0713RL  [RESC3116X65N]  (value not drawn)
R38  RC1206JR-0713RL  [RESC3116X65N]  (value not drawn)
R39  RC1206JR-0713RL  [RESC3116X65N]  (value not drawn)
T1  PQ35  [CPV-PQ3535-1S-12P-Z_FXC]  (value not drawn)

### Nets
GND: C20.2 C21.2 C30.2 C31.1 R30.1 R35.1 R36.1 R37.1 R38.1 R39.1 T1.6
GND_5V: C13.2 C14.2 C15.2 C16.2 C17.2 C18.2(N) C19.2(N) P2.2 R26.1 R27.1 R34.2 T1.12
GND_24V: C22.2 C23.2 C24.2 C25.2 C26.2 C27.2 C28.2(N) C29.2(N) C32.2 P2.4 R31.1 R32.1 R34.1 T1.9
VAUX: C20.1 C21.1 D6.K R30.2
VIN: C12.2 R24.1 R25.1 T1.1
VOUT_5V: C13.1 C16.1 C18.1(P) C19.1(P) D3.K D5.K L2.2 R26.2 R27.2
VOUT_24V: C24.1 C25.1 C27.1 C28.1(P) C29.1(P) D7.1(C) L3.2 R31.2 R32.2
ISENSE: C30.1 R33.1
VGATE: R28.1
NetC12_1: C12.1 D4.K R24.2 R25.2
NetC14_1: C14.1 C15.1 C17.1 L2.1 P2.1
NetC22_1: C22.1 C23.1 C26.1 L3.1 P2.3
NetC31_2: C31.2 C32.1
NetD3_A: D3.A D5.A T1.10
NetD4_A: D4.A Q3.D T1.3
NetD6_A: D6.A T1.4
NetD7_2: D7.2(A) T1.7
NetQ3_G: Q3.G R28.2 R29.2
NetQ3_S: Q3.S R29.1 R33.2 R35.2 R36.2 R37.2 R38.2 R39.2

Not connected (* = marked no-connect by the designer): H1 0; H2 0; H3 0; H4 0

### Notes on the sheet
- snubber circuit
- (near R24) Tro cam 2W 180KOhm (veritcal) <https://icdayroi.com/dien-tro-180k-2w>
- 470pF - 1600V
- https://s.net.vn/pg4T
- D3 nguoc
- D7 nguoc
- F_c=1/10 F_osc
- -> F_c=6.195 kHz
- (near C18) 3300uF 35V
- (near C18) 16x25mm
- 3300uF 35V
- 16x25mm
- R20 is R_CSF, combine with C28 = RC fitler
- 0.75
- (near C28) 3300uF 35V
- (near C28) 16x25mm
- Res 1206 10ohm 1/4W
- Tranformer
  Np= 35
  Ns_24=6
  Ns_5V=2
  N_bias=4 (18V)
  airgap = 0.196mm
- Project:
- XEVTECH COMPANY LIMITED
- Address: C17, Khu Barya City
- Drawn by:
- Size:
- A3
- Sheet
- of
- Date:
- TP Bà Rịa, Tỉnh Bà Rịa Vũng Tàu
- Email: admin@xevtech.vn
- Phone: 090 172 8898

### Library data of the parts
C12 = CBB22-334: CBB 630V 472J (4.7NF) 15mm; Dielectric: Metallized Polypropylene; Capacitant: 47nF; Max RMS voltage: 630V; Supply link: https://chipn24.com/g54-tu-cbb-630v-472j-p10mm-472-4-7nf-id4742.html
C13-C17 C20-C27 = Cap 1206 4.7uF: as C8 on sheet Controller; RoHS 1: Yes; Stock 1: 4126; Pricing 1: 1=0,72, 10=0,53, 50=0,4242, 100=0,3636, 500=0,28784, 1000=0,2424 (USD); Mount: Surface Mount; Case/Package: 1206; Case Code (Imperial): 1206; Case Code (Metric): 3216; Weight: 0.000571oz; Min Operating Temperature: -55°C; Max Operating Temperature: 125°C; Packaging: Tape and Reel; Tolerance: 20%; Dielectric: X7R; Termination: SMD/SMT; Voltage Rating (DC): 35V; Package Quantity: 2000; Series: CGA; Length: 0.126inch; Width: 1.6mm; Height: 1.6mm; Thickness: 0.071inch; Ratings: AEC-Q200; RoHS Compliant: Yes; ComponentLink1URL: https://product.tdk.com/info/en/catalog/datasheets/mlcc_automotive_general_en.pdf?src-supplier=Digi-Key; ComponentLink1Description: https://product.tdk.com/info/en/catalog/datasheets/mlcc_automotive_general_en.pdf?src-supplier=Digi-Key; ComponentLink2URL: http://product.tdk.com/capacitor/mlcc/detailed_information.php?lang=en&ref=jp&part_no=CGA5L1X7R1V106M160AC&src-supplier=Mouser; ComponentLink2Description: http://product.tdk.com/capacitor/mlcc/detailed_information.php?lang=en&ref=jp&part_no=CGA5L1X7R1V106M160AC&src-supplier=Mouser; ComponentLink3URL: http://product.tdk.com/capacitor/mlcc/class/print_detail_pdf.php?lang=en&part_no=CGA5L1X7R1V106M160AC&src-supplier=Avnet; ComponentLink3Description: http://product.tdk.com/capacitor/mlcc/class/print_detail_pdf.php?lang=en&part_no=CGA5L1X7R1V106M160AC&src-supplier=Avnet; ComponentLink4URL: https://product.tdk.com/info/en/catalog/spec/mlccspec_automotive_general_midvoltage_en.pdf?src-supplier=Digi-Key; ComponentLink4Description: https://product.tdk.com/info/en/catalog/spec/mlccspec_automotive_general_midvoltage_en.pdf?src-supplier=Digi-Key; Supplier 1: Digikey; Supplier Part Number 1: 445-8033-1-ND
C18 C19 C28 C29 = 860010480022: WCAP-ATG8 Aluminum Electrolytic Capacitor, Radial THT, D16xH25mm, 2700uF, 25V; Manufacturer: Wurth Elektronik; Capacitance Tolerance: +/-20%; Dissipation Factor: 14%; Endurance: 2000h; Leakage Current: 675uA; Ripple Current: 1804mA; Technical Reference: ATBK250272M025DSPAEB000; ComponentLink1Description: Manufacturer Link; ComponentLink1URL: https://www.we-online.com/redexpert/article/860010480022?ad; ComponentLink2Description: Datasheet; ComponentLink2URL: https://www.we-online.com/redexpert/spec/860010480022?ad; Category: Aluminum Electrolytic Capacitors; Match Code: WCAP-ATG8; Manufacturer Part Number: 860010480022; Mount: Through Hole; Operating Temperature Max: 85°C; Operating Temperature Min: -40°C; Packaging: Ammo Pack; Height: 25mm; Diameter: 16mm; Capacitance: 2700uF; Rated Voltage (DC): 25V
C30 = CAP 0805 100pF: CAP, CERM, 100 pF, 50 V, +/- 5%, X7R, 0805; Manufacturer 1: KEMET; Description 1: Cap Ceramic 100pF 50V X7R 5% SMD 0805 125C Paper T/R; Category 1: Ceramic Capacitors; Supplier 1: Mouser; Supplier Part Number 1: 80-C0805C101J5R; Manufacturer Part Number 1: C0805C101J5RACTU; RoHS 1: Yes; Stock 1: 27580; Pricing 1: 1=0,14, 10=0,059, 50=0,059, 100=0,034, 1000=0,027, 10000=0,022 (USD); ComponentLink1URL: http://components.arrow.com/part/dataview/42933017S9108484N7429?src-supplier=Arrow+Electronics; ComponentLink1Description: http://components.arrow.com/part/dataview/42933017S9108484N7429?src-supplier=Arrow+Electronics; ComponentLink2URL: https://datasheet.octopart.com/C0805C101J5RACTU-KEMET-datasheet-157246124.pdf?src-supplier=TME; ComponentLink2Description: https://datasheet.octopart.com/C0805C101J5RACTU-KEMET-datasheet-157246124.pdf?src-supplier=TME
C31 C32 = Cap 1206 2.2nF: 2200 pF ±10% 1000V (1kV) Ceramic Capacitor X7R 1206 (3216 Metric); Manufacturer 1: Yageo; Description 1: Multilayer Ceramic Capacitor, 2200 pF, 1000 V, ± 10%, X7R, 1206 [3216 Metric]; Category 1: Ceramic Capacitors; Material: 4241ConductorMaterial; Supplier 1: Digikey; Manufacturer Part Number 1: CC1206KKX7RCBB222; RoHS 1: Yes; Stock 1: 424375; Pricing 1: 1=0,18, 10=0,119, 50=0,0754, 100=0,0603, 500=0,04358, 1000=0,03856 (USD); Voltage Rating (AC): 1kV; ComponentLink1URL: https://datasheet.ciiva.com/11787/0900766b80d8503a-11787843.pdf?src-supplier=Rs; ComponentLink1Description: https://datasheet.ciiva.com/11787/0900766b80d8503a-11787843.pdf?src-supplier=Rs; ComponentLink2URL: https://datasheet.ciiva.com/13264/upy-gp-np0-16v-to-50v-8-3714-13264204.pdf?src-supplier=Mouser; ComponentLink2Description: https://datasheet.ciiva.com/13264/upy-gp-np0-16v-to-50v-8-3714-13264204.pdf?src-supplier=Mouser; ComponentLink3URL: https://datasheet.ciiva.com/190/mlccorderingcode-190678.pdf?src-supplier=Digikey; ComponentLink3Description: https://datasheet.ciiva.com/190/mlccorderingcode-190678.pdf?src-supplier=Digikey; ComponentLink4URL: https://datasheet.ciiva.com/190/mlccorderingcode-190679.pdf?src-supplier=Digikey; ComponentLink4Description: https://datasheet.ciiva.com/190/mlccorderingcode-190679.pdf?src-supplier=Digikey; ComponentLink5URL: https://datasheet.ciiva.com/190/mlccorderingcode-190680.pdf?src-supplier=Digikey; ComponentLink5Description: https://datasheet.ciiva.com/190/mlccorderingcode-190680.pdf?src-supplier=Digikey; Supplier Part Number 1: 311-1511-1-ND
D3-D6 = DIODE 1000V 3A: DIODE GEN PURP 1KV 3A SMB; Manufacturer: Diodes Inc.; Peak Reverse Current: 10uA; Max Junction Temp: +150°C; Reverse Voltage: 1000V; Standoff Height: 0.05mm; Max Surge Forward Current: 100A; Capacitance: 40pF; Value: 40pF; Automotive: No; Device Class L1: Discrete Semiconductors; ComponentLink2Description: Datasheet; Temperature Range Low: -65°C; Lead Free: Yes; Height: 2.5mm; Device Class L3: Rectifier Diodes; Footprint Url: https://www.diodes.com/assets/Package-Files/SMB.pdf; Device Class L2: Diodes; Octopart: https://octopart.com/s3mb-13-f-diodes+inc.-333387; Temperature: -65°C to +150°C; ComponentLink2URL: https://www.diodes.com/assets/Datasheets/ds16005.pdf; RoHS: TRUE; Max Repetitive Reverse Voltage: 1000V; Package: SMB; Digikey Description: DIODE GEN PURP 1KV 3A SMB; Category: Diode; Manufacturer Part Number: S3MB-13-F; Forward Current: 3A; Mouser Description: Rectifiers 1000V 3A; Temperature Range High: +150°C; Supplier 1: Digikey; Supplier Part Number 1: S3MB-FDICT-ND
L2 L3 = CDRH127/LDNP-470MC: 47 ÂµH Shielded - Inductor 3.25 A 78mOhm Max Nonstandard; MF: Sumida America; SnapEDA_Link: https://www.snapeda.com/parts/CDRH127/LDNP-470MC/Sumida+America+Components+Inc./view-part/?ref=snap; MP: CDRH127/LDNP-470MC; Availability: In Stock; Price: None; Value: *; Check_prices: https://www.snapeda.com/parts/CDRH127/LDNP-470MC/Sumida+America+Components+Inc./view-part/?ref=eda; Package: Nonstandard Sumida; Purchase-URL: https://pricing.snapeda.com/search/part/CDRH127/LDNP-470MC/?ref=eda
P2 = Domino 4: Domino 4-Pin; LatestRevisionDate: 17-Jul-2002; LatestRevisionNote: Re-released for DXP Platform.; Publisher: Altium Limited
Q3 = SIHG11N80AE-GE3: MOSFET N-CH 800V 8A TO247AC; Manufacturer_Name: onsemi; Manufacturer_Part_Number: NVHL160N120SC1; Datasheet Link: https://www.onsemi.com/pdf/datasheet/nvhl160n120sc1-d.pdf; Height: 4.82mm; Mouser Part Number: 863-NVHL160N120SC1; Mouser Price/Stock: https://www.mouser.co.uk/ProductDetail/ON-Semiconductor/NVHL160N120SC1?qs=GedFDFLaBXGyNe%2F0JxjRIw%3D%3D; Arrow Part Number: NVHL160N120SC1; Arrow Price/Stock: https://www.arrow.com/en/products/nvhl160n120sc1/on-semiconductor; Supplier 1: Digikey; Supplier Part Number 1: 742-SIHG11N80AE-GE3-ND
R24 R25 = Res: Manufacturer: Generic Components; Class: Passive; SubClass: R; Published: 08/06/2000; Publisher: Altium Hobart Technology Centre
R26 R27 R29-R32 = RES_0805_10k: as R8 on sheet Controller; Supplier 1: Digi-Key; Supplier Part Number 1: 13-RC0805FR-1310KLDKR-ND
R28 = RES_0805_22R: as R9 on sheet Controller; Supplier 1: Digikey; RoHS 1: Yes; Stock 1: 24620; Pricing 1: 1=0,1, 10=0,029, 50=0,0188, 100=0,0158, 500=0,01096, 1000=0,00948 (USD); ComponentLink1URL: http://www.mouser.com/ds/2/447/yageodocoutput-1111992.pdf?src-supplier=Mouser; ComponentLink1Description: http://www.mouser.com/ds/2/447/yageodocoutput-1111992.pdf?src-supplier=Mouser; ComponentLink2URL: http://www.yageo.com/NewPortal/yageodocoutput?fileName=/pdf/R-Chip/PYu-AC_51_RoHS_L_6.pdf&src-supplier=Digi-Key; ComponentLink2Description: http://www.yageo.com/NewPortal/yageodocoutput?fileName=/pdf/R-Chip/PYu-AC_51_RoHS_L_6.pdf&src-supplier=Digi-Key; ComponentLink3URL: https://www.yageo.com/upload/media/product/productsearch/datasheet/rchip/PYu-AC_51_RoHS_L_7.pdf?src-supplier=Digi-Key; ComponentLink3Description: https://www.yageo.com/upload/media/product/productsearch/datasheet/rchip/PYu-AC_51_RoHS_L_7.pdf?src-supplier=Digi-Key; ComponentLink4URL: http://www.yageo.com/NewPortal/yageodocoutput?fileName=/pdf/R-Chip/PYu-AC_51_RoHS_L_5.pdf&src-supplier=Digi-Key; ComponentLink4Description: http://www.yageo.com/NewPortal/yageodocoutput?fileName=/pdf/R-Chip/PYu-AC_51_RoHS_L_5.pdf&src-supplier=Digi-Key; ComponentLink5URL: https://datasheet.octopart.com/AC0805FR-0733RL-Yageo-datasheet-151884373.pdf?src-supplier=Future+Electronics; ComponentLink5Description: https://datasheet.octopart.com/AC0805FR-0733RL-Yageo-datasheet-151884373.pdf?src-supplier=Future+Electronics; Supplier Part Number 1: 13-RC0805FR-0722RPCT-ND
R33 = RES_0805_470: 470 Ohms ±1% 0.125W, 1/8W Chip Resistor 0805 (2012 Metric) Moisture Resistant Thick Film; Supplier 1: Digikey; Supplier Part Number 1: 13-RC0805FR-07470RPCT-ND
R34 = RES_1206_0R: 0 Ohms ±5% 1W, Moisture Resistant Thick Film; Manufacturer_Name: Bourns; Manufacturer_Part_Number: CR1206-F/-2R00ELF; Height: 0.75mm; Mouser Part Number: 652-CR1206-F/2R00ELF; Mouser Price/Stock: https://www.mouser.co.uk/ProductDetail/Bourns/CR1206-F-2R00ELF?qs=W%2FMpXkg%252BdQ47Z%2FeZv1nDSg%3D%3D; Supplier 1: Digikey; Supplier Part Number 1: 541-4322-1-ND
R35-R39 = RC1206JR-0713RL: as R1 on sheet EMI_Filter; Check_prices: https://www.snapeda.com/parts/RC1206JR-0713RL/Yageo/view-part/?ref=eda; Value: *; Availability: In Stock; MP: RC1206JR-0713RL; Price: None; Package: 3116 Yageo; SnapEDA_Link: https://www.snapeda.com/parts/RC1206JR-0713RL/Yageo/view-part/?ref=snap; Purchase-URL: https://pricing.snapeda.com/search/part/RC1206JR-0713RL/?ref=eda
T1 = PQ35: Main Tranformer with 2 output line

## Nets that join several sheets
GND: EMI_Filter (5 pins), Controller (13 pins), Transformer (11 pins)
GND_24V: Controller (IC2.3 R22.2 VR1.1), Transformer (14 pins)
VAUX: Controller (R9.1 R17.2), Transformer (C20.1 C21.1 D6.K R30.2)
VIN: EMI_Filter (5 pins), Controller (R4.2), Transformer (C12.2 R24.1 R25.1 T1.1)
VOUT_24V: Controller (R13.2 R14.2), Transformer (9 pins)
ISENSE: Controller (IC1.3), Transformer (C30.1 R33.1)
VGATE: Controller (IC1.6), Transformer (R28.1)